# Altium schematic sheet etna-main-driver.SchDoc
size A4; DocumentNumber: 1; SheetNumber: 5; SheetTotal: 5; PageSetup: Record=PageOptions|CenterHorizontal=True|CenterVertical=True|PrintScale=0.73|XCorrection=1.00|YCorrection=1.00|PrintKind=1|BorderSize=5000000|LeftOffset=0|BottomOffset=0|Orientation=2|PaperLength=1000|PaperWidth=1000|Scale=100|PaperSource=15|PrintQuality=1200|MediaType=1|DitherType=10|PaperKind=A4|PrintScaleMode=1
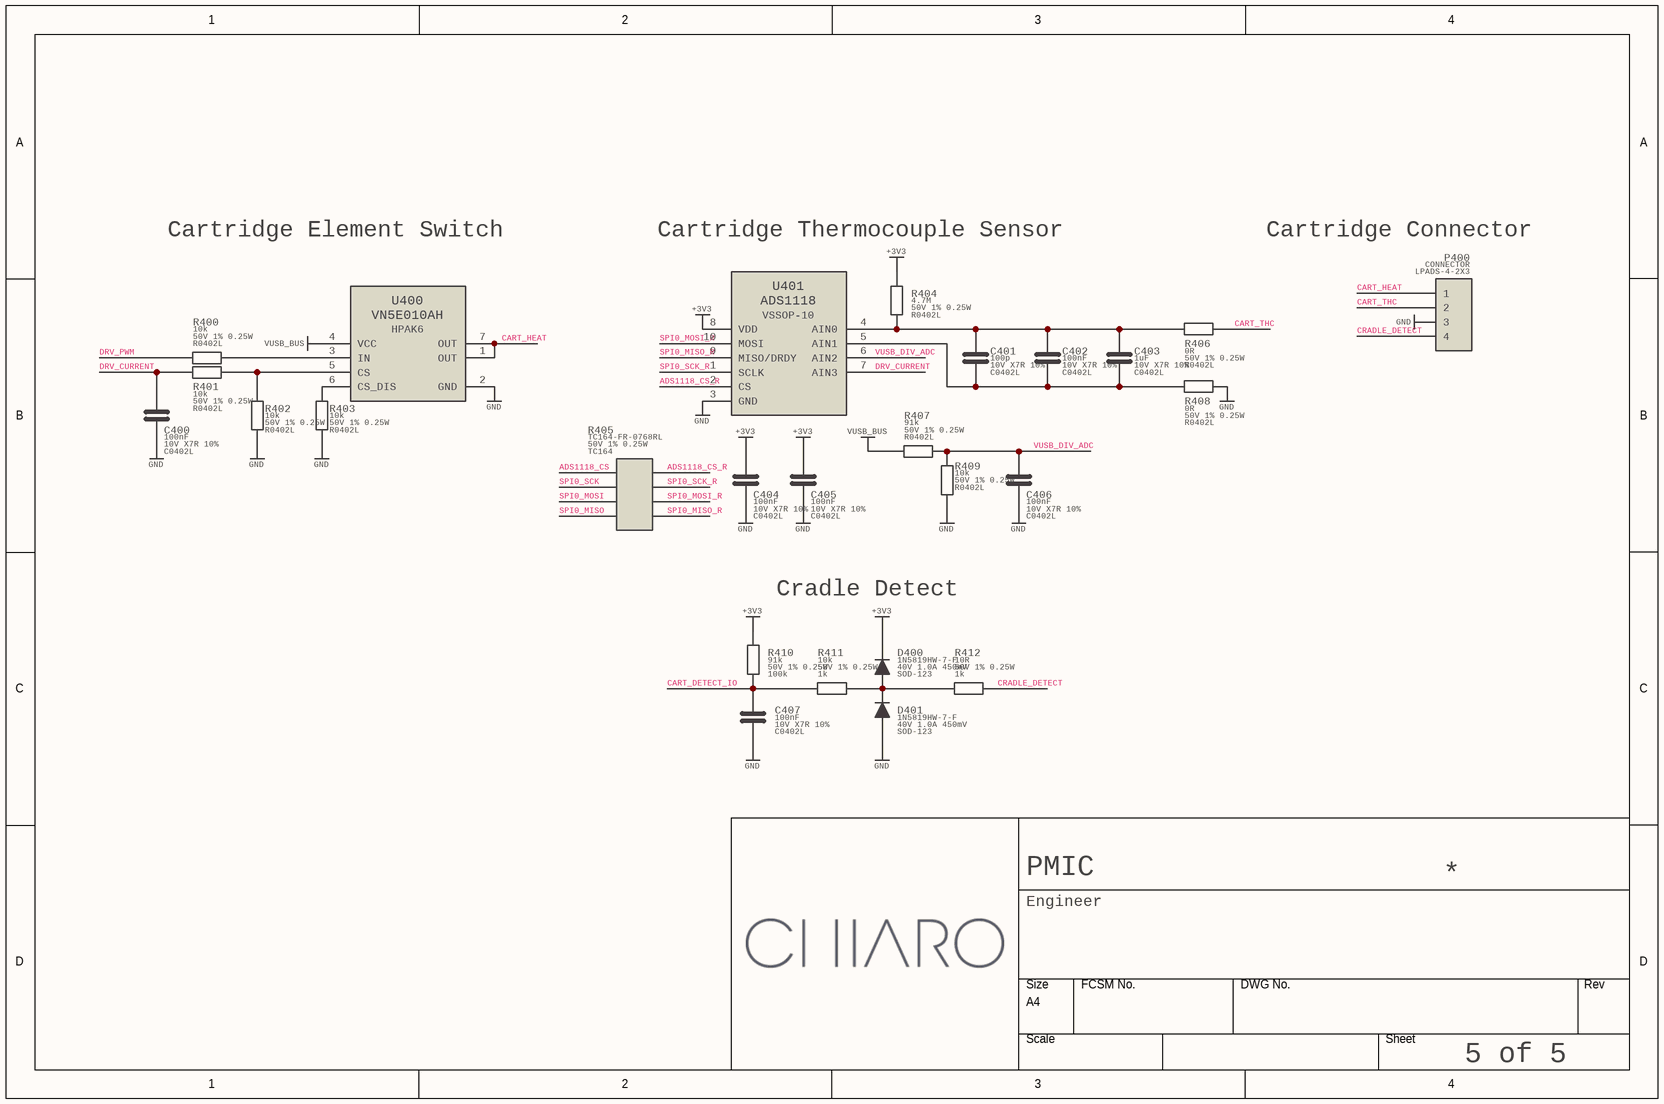
[diagram p0: etna-main-driver.SchDoc]

## Parts
C400  value 100nF  Specification: 10V X7R 10%  [C0402L]
C401  value 100p  Specification: 10V X7R 10%  [C0402L]
C402  value 100nF  Specification: 10V X7R 10%  [C0402L]
C403  value 1uF  Specification: 10V X7R 10%  [C0402L]
C404  value 100nF  Specification: 10V X7R 10%  [C0402L]
C405  value 100nF  Specification: 10V X7R 10%  [C0402L]
C406  value 100nF  Specification: 10V X7R 10%  [C0402L]
C407  value 100nF  Specification: 10V X7R 10%  [C0402L]
D400  value 1N5819HW-7-F  Specification: 40V 1.0A 450mV  [SOD-123]  (hidden comment: DIODE)
D401  value 1N5819HW-7-F  Specification: 40V 1.0A 450mV  [SOD-123]  (hidden comment: DIODE)
P400  value CONNECTOR  [LPADS-4-2X3]  (hidden comment: H4)
R400  value 10k  Specification: 50V 1% 0.25W  [R0402L]  (hidden comment: RESISTOR)
R401  value 10k  Specification: 50V 1% 0.25W  [R0402L]  (hidden comment: RESISTOR)
R402  value 10k  Specification: 50V 1% 0.25W  [R0402L]  (hidden comment: RESISTOR)
R403  value 10k  Specification: 50V 1% 0.25W  [R0402L]  (hidden comment: RESISTOR)
R404  value 4.7M  Specification: 50V 1% 0.25W  [R0402L]  (hidden comment: RESISTOR)
R405  value TC164-FR-0768RL  Specification: 50V 1% 0.25W  [TC164]  (hidden comment: RESISTOR_4)
R406  value 0R  Specification: 50V 1% 0.25W  [R0402L]  (hidden comment: RESISTOR)
R407  value 91k  Specification: 50V 1% 0.25W  [R0402L]  (hidden comment: RESISTOR)
R408  value 0R  Specification: 50V 1% 0.25W  [R0402L]  (hidden comment: RESISTOR)
R409  value 10k  Specification: 50V 1% 0.25W  [R0402L]  (hidden comment: RESISTOR)
R410  value 91k  Footprint: 100k  Specification: 50V 1% 0.25W  [R0402L]  (hidden comment: RESISTOR)
R411  value 10k  Footprint: 1k  Specification: 50V 1% 0.25W  [R0402L]  (hidden comment: RESISTOR)
R412  value 10R  Footprint: 1k  Specification: 50V 1% 0.25W  [R0402L]  (hidden comment: RESISTOR)
U400  VN5E010AH  [HPAK6]
U401  ADS1118  [VSSOP-10]

## Nets
+3V3: C404.1 C405.1 D400.2(K) R404.2 R410.1 U401.8(VDD)
GND: C400.2 C404.2 C405.2 C406.2 C407.2 D401.1(A) P400.3 R402.1 R403.1 R408.1 R409.1 U400.2(GND) U401.3(GND)
VUSB_BUS: R407.1 U400.4(VCC)
ADS1118_CS: R405.1
ADS1118_CS_R: R405.8 U401.2(CS)
CART_DETECT_IO: C407.1 R410.2 R411.2
CART_HEAT: P400.1 U400.1(OUT) U400.7(OUT)
CART_THC: P400.2 R406.1
CRADLE_DETECT: P400.4 R412.1
DRV_CURRENT: C400.1 R401.2 U401.7(AIN3)
DRV_PWM: R400.2
SPI0_MISO: R405.4
SPI0_MISO_R: R405.5 U401.9(MISO/DRDY)
SPI0_MOSI: R405.3
SPI0_MOSI_R: R405.6 U401.10(MOSI)
SPI0_SCK: R405.2
SPI0_SCK_R: R405.7 U401.1(SCLK)
VUSB_DIV_ADC: C406.1 R407.2 R409.2 U401.6(AIN2)
NetC401_1: C401.1 C402.1 C403.1 R404.1 R406.2 U401.4(AIN0)
NetC401_2: C401.2 C402.2 C403.2 R408.2 U401.5(AIN1)
NetD400_1: D400.1(A) D401.2(K) R411.1 R412.2
NetR400_1: R400.1 U400.3(IN)
NetR401_1: R401.1 R402.2 U400.5(CS)
NetR403_2: R403.2 U400.6(CS_DIS)

Not connected (* = marked no-connect by the designer): U400 44(N.C.); U401 44(N.C.)

## Notes on the sheet
- Cartridge Element Switch
- (near R404) Cartridge Thermocouple Sensor
- (near P400) Cartridge Connector
- Cradle Detect
- PMIC
- Engineer

## Library data of the parts
C400-C407 = CAPACITOR_NONPOL
U400 = VN5E010AH: Value: VN5E010AH
U401 = ADS1118: Value: ADS1118